# Altium schematic sheet Sheet1.SchDoc: Наименование
size 209 x 297 mm; ApprovedBy: Утвердил; CheckedBy: Проверил; Author: Разработал; CompanyName: Организация; DrawnBy: Н.Контр; Engineer: Т.Контр; SheetNumber: 1; SheetTotal: 6; PageSetup: Record=PageOptions|CenterHorizontal=True|CenterVertical=True|PrintScale=0.94|XCorrection=1.00|YCorrection=1.00|PrintKind=1|BorderSize=5000000|LeftOffset=0|BottomOffset=0|Orientation=1|PaperLength=1000|PaperWidth=1000|Scale=100|PaperSource=7|PrintQuality=-4|MediaType=1|DitherType=10|PaperKind=A4|PrintScaleMode=1; DecimalNumber: Децимальный номер; HeadOfSector: Нач. сектора; MainDevice: Перв.примен.; Name: Наименование; DocumentName: Sheet1.SCHDOC
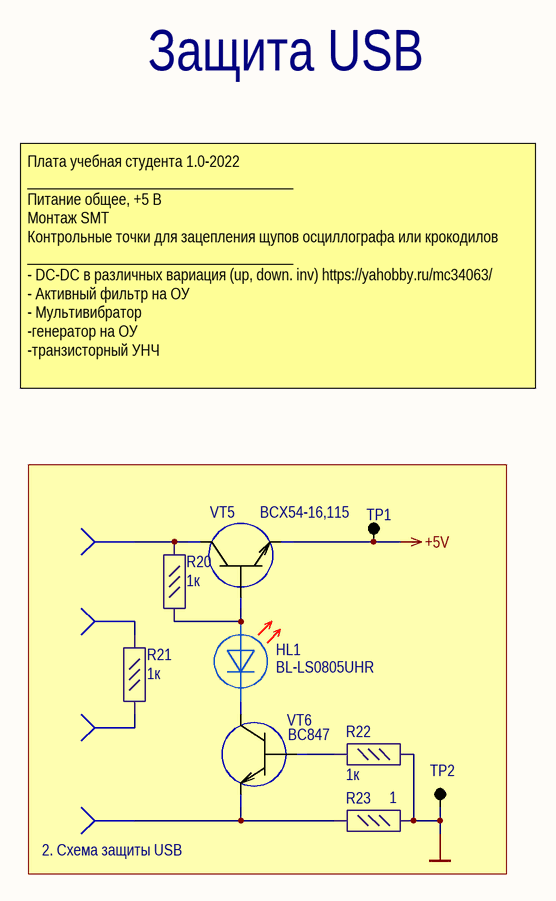
[diagram p0: Sheet1.SchDoc]

## Parts
HL1  BL-LS0805UHR  [LED_0805_RED]
R20  1к  [R_0603]
R21  1к  [R_0603]
R22  1к  [R_0603]
R23  1  [R_0603]
TP1  Test_Point_1  [Test_point]  (value not drawn)
TP2  Test_Point_1  [Test_point]  (value not drawn)
VT5  BCX54-16,115  [SOT89]
VT6  BC847  [SOT23]
X1  X  [KT_1]  (value not drawn)
X2  X  [KT_1]  (value not drawn)
X3  X  [KT_1]  (value not drawn)
X4  X  [KT_1]  (value not drawn)

## Blocks framed on the sheet
2. Схема защиты USB: HL1 R20-R23 TP1 TP2 VT5 VT6 X1-X4

## Nets
+5V: TP1.1 VT5.3(E)
GND: R22.2 R23.2 TP2.1
NetHL1_1: HL1.1 R20.2 VT5.1(B)
NetHL1_2: HL1.2 VT6.3(C)
NetR20_1: R20.1 VT5.2(C) X1.1
NetR21_1: R21.1 X2.1
NetR21_2: R21.2 X3.1
NetR22_1: R22.1 VT6.1(B)
NetR23_1: R23.1 VT6.2(E) X4.1

## Notes on the sheet
- Защита USB
- Плата учебная студента 1.0-2022
  ___________________________________
  Питание общее, +5 В
  Монтаж SMT
  Контрольные точки для зацепления щупов осциллографа или крокодилов
  ___________________________________
  - DC-DC в различных вариация (up, down. inv) https://yahobby.ru/mc34063/
  - Активный фильтр на ОУ
  - Мультивибратор
  -генератор на ОУ
  -транзисторный УНЧ
- Перв.примен.
- Справ.№
- Подп. и дата
- Инв.№ дубл.
- Взам.инв.№
- Подп.и дата
- Разраб.
- Изм.
- Лист
- № докум.
- Подп.
- Дата
- Лит.
- Масштаб
- Масса
- Т.контр.
- Пров.
- ПРИНЦИПИАЛЬНАЯ
- СХЕМА   ЭЛЕКТРИЧЕСКАЯ
- Листов
- Инв.№ подл.
- Утв.
- Н.контр.
- Нач.сект.
- Копировал
- Формат  A3

## Library data of the parts
R20-R23 = CR0603-FX-1002ELF: RES SMD 10K OHM 1% 1/10W 0603; Manufacturer: Bourns Inc.; Value: 10 к; Part Number: CR0603-FX-1002ELF; ComponentLink1URL: https://www.bourns.com/pdfs/chpreztr.pdf; ComponentLink1Description: Datasheet; Component Type: Resistor
X1-X4 = X: Контактная площадка